# EAGLE design DS2502_prog (EAGLE 6.5.0)
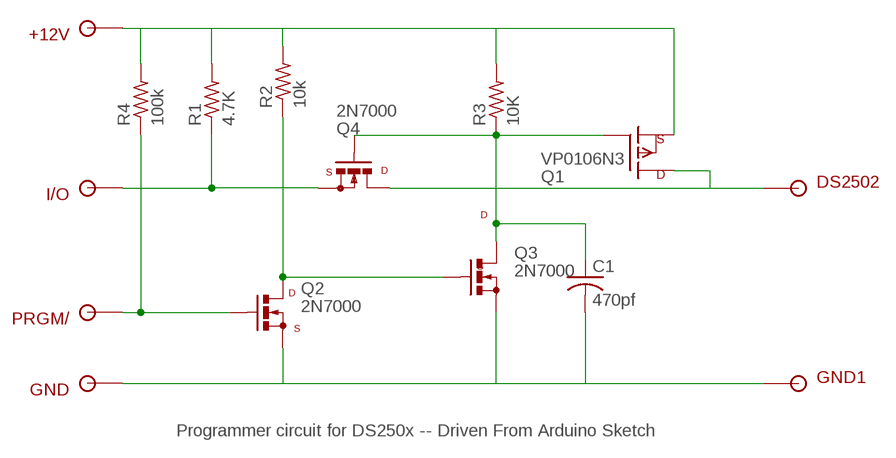
[diagram p0: schematic, sheet 1]

## Parts
+12V  SOLDER_POINTA  [P1-13]
C1  470pf  C-US025-025X050  [C025-025X050]
DS2502  SOLDER_POINTA  [P1-13]
GND  SOLDER_POINTA  [P1-13]
GND1  SOLDER_POINTA  [P1-13]
I/O  SOLDER_POINTA  [P1-13]
PRGM/  SOLDER_POINTA  [P1-13]
Q1  VP0106N3  BSS110TO920  [TO92-]
Q2  2N7000  BS170T092-  [TO92-LINE]
Q3  2N7000  BS170T092-  [TO92-LINE]
Q4  2N7000  BS170T092-  [TO92-LINE]
R1  4.7K  R-US_0207/2V  [0207/2V]
R2  10k  R-US_0309/10  [0309/10]
R3  10K  R-US_0207/2V  [0207/2V]
R4  100k  R-US_0309/10  [0309/10]

## Nets
N$1: +12V.1 Q1.3(S) R1.2 R2.2 R3.2 R4.2
N$2: I/O.1 Q4.3(S) R1.1
N$3: Q2.1(D) Q3.2(G) R2.1
N$4: PRGM/.1 Q2.2(G) R4.1
N$5: C1.2 GND1.1 GND.1 Q2.3(S) Q3.3(S)
N$6: C1.1 Q1.2(G) Q3.1(D) Q4.2(G) R3.1
N$7: DS2502.1 Q1.1(D) Q4.1(D)

## Notes on the sheet
- S | D
- D
- S
- D
- S
- Programmer circuit for DS250x -- Driven From Arduino Sketch

## Library data of the parts
+12V DS2502 GND GND1 I/O PRGM/ = 1AA_Stofer:SOLDER_POINT
C1 = rcl:C-US: CAPACITOR, American symbol
Q1 = transistor-fet:BSS110: P-Channel Enhancement MOSFET -50V; -0,17A; 6Ohm
Q2-Q4 = transistor-small-signal:BS170: N-CHANNEL MOS FET
R1-R4 = rcl:R-US_: RESISTOR, American symbol

## Board
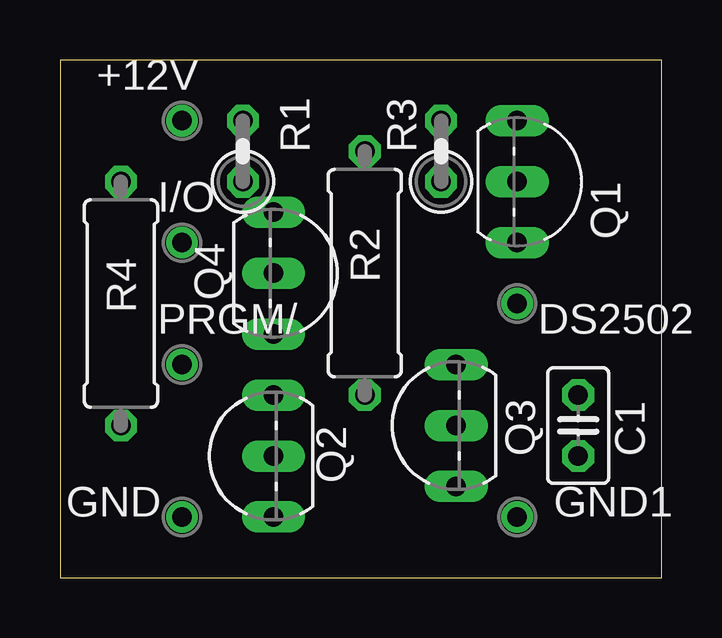
[diagram p1: board, top side]
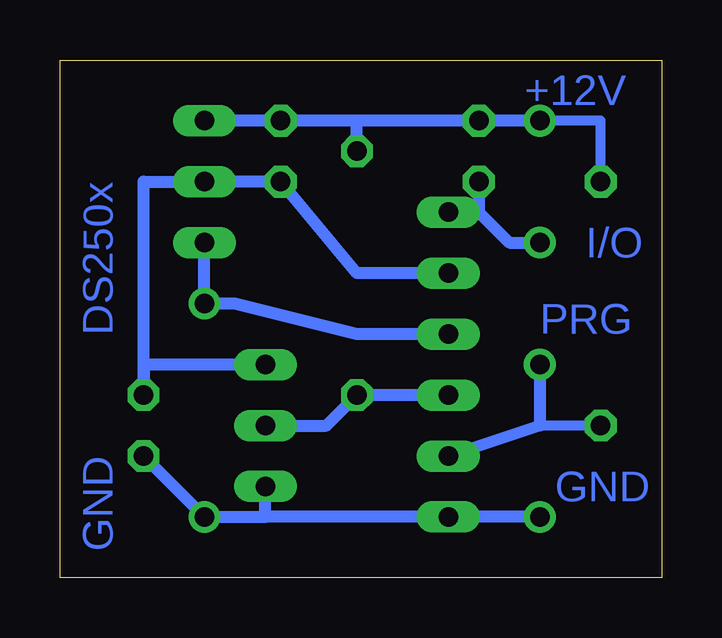
[diagram p2: board, bottom side, seen from below]

Size 25.07 x 21.58 mm. Coordinates in mm from the lower left corner, seen from the top.
Outline: 0,0 25.07,0 25.07,21.58 0,21.58 0,0
Copper layers (1*16): Top 0.035mm / dielectric 1.5mm / Bottom 0.035mm
Design rules "default *": minimum track width 10mil, minimum drill 0.6mm, track to track 8mil, track to pad 8mil, pad to pad 8mil, via to via 8mil, smd to smd 8mil, copper to edge 40mil, drill to drill 8mil, minimum pad ring 10mil, minimum via ring 8mil, stop-mask expansion 4mil, vias tented up to drill 0mil, thermal gap 10mil

### Footprints (pad centres in the part's own frame; a part is rotated, then mirrored left to right if it is on the bottom)
P1-13 = drill 0.813: 1 0,0
C025-025X050 = drill 0.813 octagon: 1 -1.27,0; 2 1.27,0
TO92- = drill 0.813 long: 1 2.54,0; 2 0,0; 3 -2.54,0
TO92-LINE = drill 0.813 long: 1 2.54,0; 2 0,0; 3 -2.54,0
0207/2V = drill 0.813 octagon: 1 -1.27,0; 2 1.27,0
0309/10 = drill 0.813 octagon: 1 -5.08,0; 2 5.08,0

### Placement (x,y rotation side)
+12V  5.08,19.05 0 top
C1  21.59,6.35 270 top
DS2502  19.05,11.43 0 top
GND  5.08,2.54 0 top
GND1  19.05,2.54 0 top
I/O  5.08,13.97 0 top
PRGM/  5.08,8.89 0 top
Q1  19.05,16.51 270 top
Q2  8.89,5.08 90 top
Q3  16.51,6.35 90 top
Q4  8.89,12.7 270 top
R1  7.62,17.78 90 top
R2  12.7,12.7 90 top
R3  15.88,17.78 90 top
R4  2.54,11.43 90 top

### Tracks (layer width: path | path; a pad name or v marks a point on that pad's centre or on a via)
N$1
  Bottom 0.406: R4.2 2.54,19.05 +12V.1
  Bottom 0.508: R2.2 12.7,19.05 | Q1.3 R3.2 12.7,19.05 | +12V.1 R1.2 12.7,19.05
N$2
  Bottom 0.508: I/O.1 6.35,13.97 7.62,15.24 | R1.1 7.62,15.24 | Q4.3 7.62,15.24
N$3
  Bottom 0.508: Q2.1 R2.1 13.97,6.35 Q3.2
N$4
  Bottom 0.406: R4.1 5.08,6.35
  Bottom 0.508: PRGM/.1 5.08,6.35 Q2.2
N$5
  Bottom 0.508: 16.51,2.54 GND1.1 C1.2 | 16.51,2.54 Q3.3 | GND.1 Q2.3 16.51,2.54
N$6
  Bottom 0.508: Q4.2 12.7,12.7 R3.1 Q1.2 21.59,16.51 C1.1 21.59,8.89 Q3.1
N$7
  Bottom 0.508: Q4.1 12.7,10.16 17.78,11.43 DS2502.1 Q1.1

### Text on the board
Bottom: +12V | DS250x | I/O | PRG | GND | GND